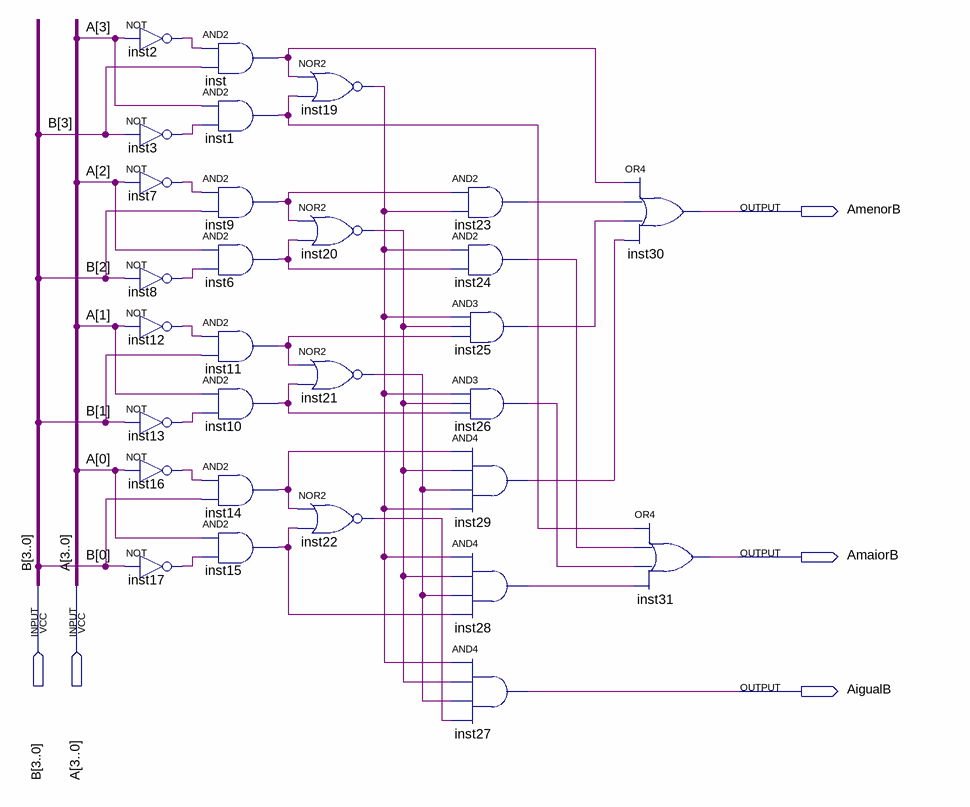
[diagram p0: schematic sheet]
// Quartus schematic COMPARATOR_4BITS.bdf as structural Verilog: 29 symbols, 5 pins
module COMPARATOR_4BITS (
  input  [3:0] B,
  input  [3:0] A,
  output AmenorB,
  output AmaiorB,
  output AigualB
);

  wire inst1_out, inst2_out, inst3_out, inst6_out, inst7_out, inst8_out, inst9_out, inst10_out, inst11_out,
       inst12_out, inst13_out, inst14_out, inst15_out, inst16_out, inst17_out, inst19_out, inst20_out,
       inst21_out, inst22_out, inst23_out, inst24_out, inst25_out, inst26_out, inst28_out, inst29_out,
       inst_out;

  not inst2 (inst2_out, A[3]);
  not inst3 (inst3_out, B[3]);
  not inst7 (inst7_out, A[2]);
  not inst8 (inst8_out, B[2]);
  not inst12 (inst12_out, A[1]);
  not inst13 (inst13_out, B[1]);
  not inst16 (inst16_out, A[0]);
  not inst17 (inst17_out, B[0]);
  and inst (inst_out, inst2_out, B[3]);
  and inst1 (inst1_out, A[3], inst3_out);
  and inst9 (inst9_out, inst7_out, B[2]);
  and inst6 (inst6_out, A[2], inst8_out);
  and inst11 (inst11_out, inst12_out, B[1]);
  and inst10 (inst10_out, A[1], inst13_out);
  and inst14 (inst14_out, inst16_out, B[0]);
  and inst15 (inst15_out, A[0], inst17_out);
  nor inst19 (inst19_out, inst_out, inst1_out);
  nor inst20 (inst20_out, inst9_out, inst6_out);
  nor inst21 (inst21_out, inst11_out, inst10_out);
  nor inst22 (inst22_out, inst14_out, inst15_out);
  and inst23 (inst23_out, inst9_out, inst19_out);
  and inst24 (inst24_out, inst19_out, inst6_out);
  and inst25 (inst25_out, inst19_out, inst20_out, inst11_out);
  and inst26 (inst26_out, inst19_out, inst20_out, inst10_out);
  and inst29 (inst29_out, inst14_out, inst20_out, inst21_out, inst19_out);
  and inst28 (inst28_out, inst19_out, inst20_out, inst21_out, inst15_out);
  and inst27 (AigualB, inst19_out, inst20_out, inst21_out, inst22_out);
  or inst30 (AmenorB, inst_out, inst23_out, inst25_out, inst29_out);
  or inst31 (AmaiorB, inst1_out, inst24_out, inst26_out, inst28_out);
endmodule
